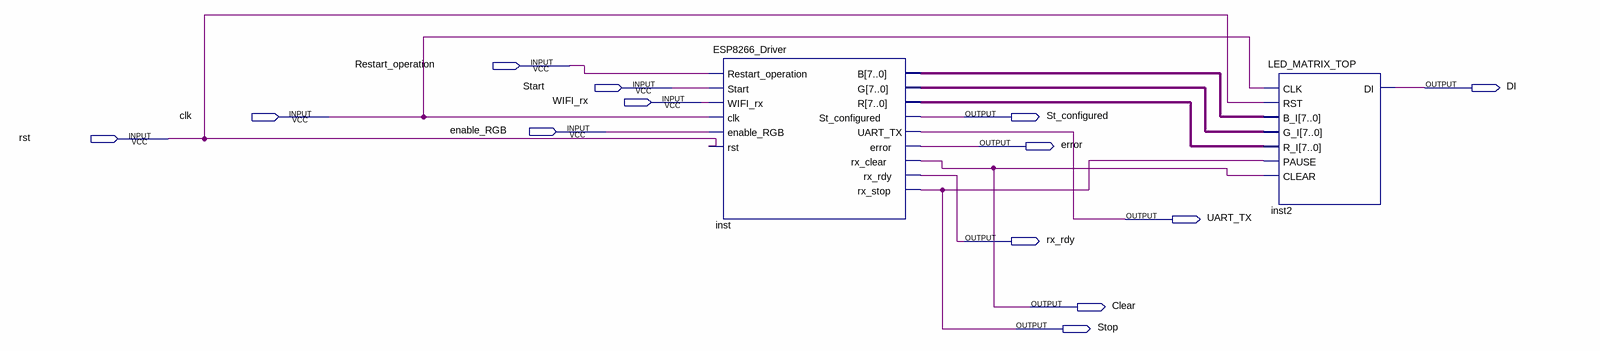
[diagram p0: schematic sheet]
// Quartus schematic esp8266_driver_struct.bdf as structural Verilog: 2 symbols, 13 pins
module esp8266_driver_struct (
  input  Restart_operation,
  input  Start,
  input  WIFI_rx,
  input  clk,
  input  enable_RGB,
  input  rst,
  output DI,
  output St_configured,
  output error,
  output UART_TX,
  output rx_rdy,
  output Clear,
  output Stop
);

  wire [7:0] inst_b, inst_g, inst_r;

  ESP8266_Driver inst (
    .Restart_operation(Restart_operation), .Start(Start), .WIFI_rx(WIFI_rx), .clk(clk),
    .enable_RGB(enable_RGB), .rst(rst), .B(inst_b), .G(inst_g), .R(inst_r), .St_configured(St_configured),
    .UART_TX(UART_TX), .error(error), .rx_clear(Clear), .rx_rdy(rx_rdy), .rx_stop(Stop));
  LED_MATRIX_TOP inst2 (
    .CLK(clk), .RST(rst), .B_I(inst_b), .G_I(inst_g), .R_I(inst_r), .PAUSE(Stop), .CLEAR(Clear), .DI(DI));
endmodule
